# EAGLE schematic smart-kitchen-autofan (EAGLE 9.5.2)
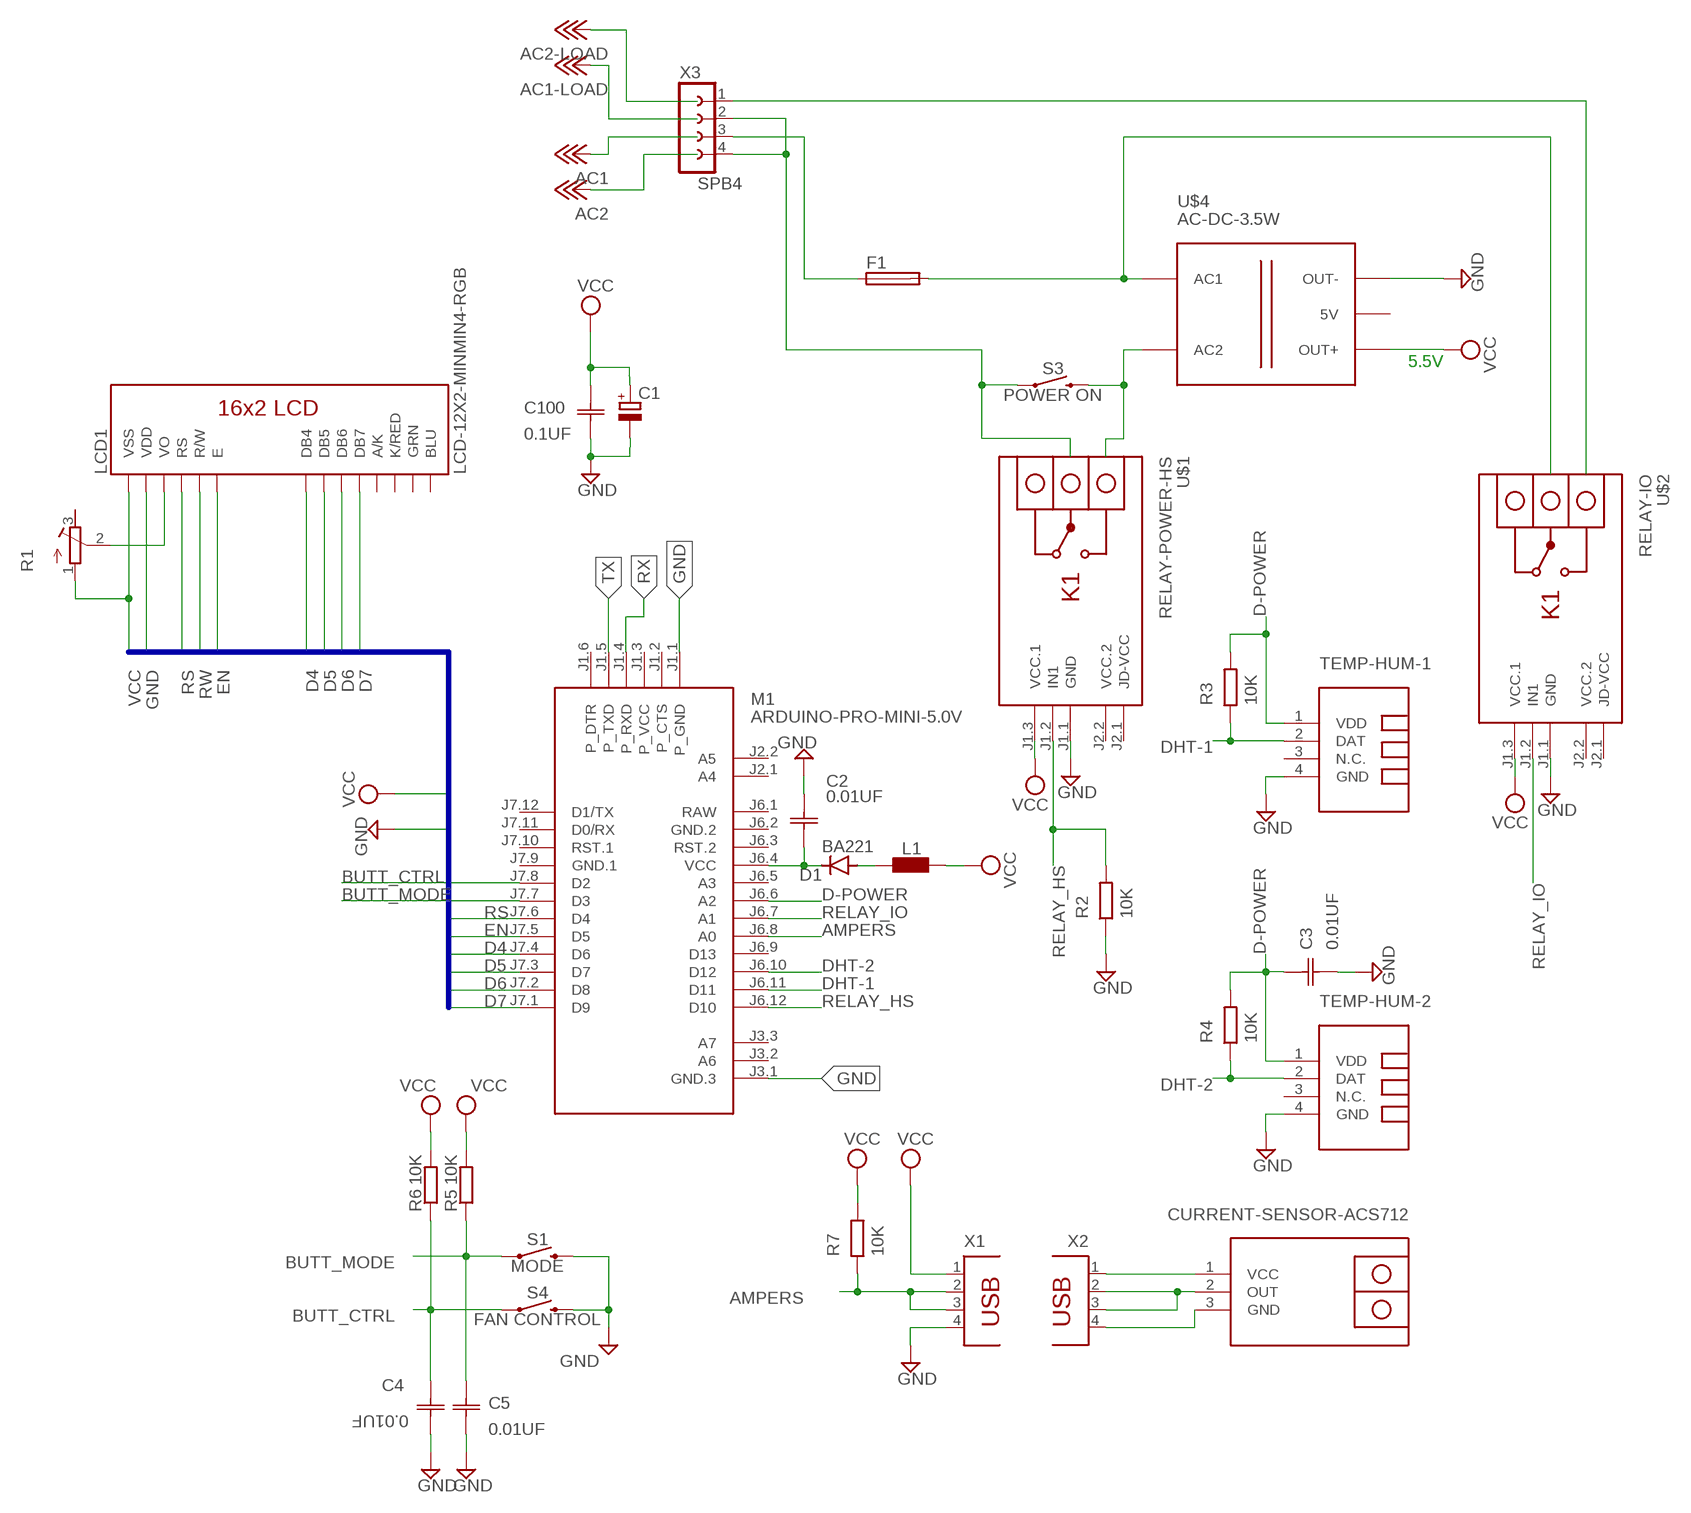
[diagram p0: schematic, sheet 1]

## Parts
C1  CPOL-EU139CLL-2R  [139CLL-2R]
C2  0.01UF  0603ZC104KA72A  [CAPC1608X90N]
C3  0.01UF  0603ZC104KA72A  [CAPC1608X90N]
C4  0.01UF  0603ZC104KA72A  [CAPC1608X90N]
C5  0.01UF  0603ZC104KA72A  [CAPC1608X90N]
C100  0.1UF  0603ZC104KA72A  [CAPC1608X90N]
D1  BA221  [DO35-10]
F1  F457  [F457]
L1  L0207/10  [0207/10]
LCD1  LCD-12X2-MINMIN4-RGB  LCD-16X2-MINMIN4-RGB  [LCD-16X2_NOSILK-KIT-4BIT]
M1  ARDUINO-PRO-MINI-5.0V  [ARDUINO-PRO-MINI]
R1  R-TRIMM5W  [RTRIM5W]
R2  10K  R  (no package)
R3  10K  R  (no package)
R4  10K  R  (no package)
R5  10K  R  (no package)
R6  10K  R  (no package)
R7  10K  R  (no package)
S1  MODE  MOMENTARY-SWITCH-SPST-PTH-6.0MM  [TACTILE_SWITCH_PTH_6.0MM]
S3  POWER ON  MOMENTARY-SWITCH-SPST-PTH-6.0MM  [TACTILE_SWITCH_PTH_6.0MM]
S4  FAN CONTROL  MOMENTARY-SWITCH-SPST-PTH-6.0MM  [TACTILE_SWITCH_PTH_6.0MM]
U$1  RELAY-POWER-HS  RELAY-1-SRD  [RELAY-1-SRD]
U$2  RELAY-IO  RELAY-1-SRD  [RELAY-1-SRD]
U$3  CURRENT-SENSOR-ACS712  [CURRENT-SENSOR-ACS712]
U$4  AC-DC-3.5W  [AC-DC-3.5W]
U$7  TEMP-HUM-1  TEMP-HUM-SENSOR-DHT22  [TEMP-HUM-SENSOR-DHT22]
U$8  TEMP-HUM-2  TEMP-HUM-SENSOR-DHT22  [TEMP-HUM-SENSOR-DHT22]
X1  PN61729  [PN61729]
X2  PN61729  [PN61729]
X3  SPB4  [SPB4]

## Nets
AMPERS: M1.J6.8(A0) R7.1 X1.2 X1.3
BUTT_CTRL: C4.1(C1) M1.J7.8(D2) R6.1 S4.1
BUTT_MODE: C5.1(C1) M1.J7.7(D3) R5.1 S1.1
D4: LCD1.11(DB4) M1.J7.4(D6)
D5: LCD1.12(DB5) M1.J7.3(D7)
D6: LCD1.13(DB6) M1.J7.2(D8)
D7: LCD1.14(DB7) M1.J7.1(D9)
D-POWER: C3.2(C2) M1.J6.6(A2) R3.2 R4.2 U$7.1(VDD) U$8.1(VDD)
DHT-1: M1.J6.11(D11) R3.1 U$7.2(DAT)
DHT-2: M1.J6.10(D12) R4.1 U$8.2(DAT)
EN: LCD1.6(E) M1.J7.5(D5)
GND: C1.- C2.2(C2) C3.1(C1) C4.2(C2) C5.2(C2) C100.1(C1) LCD1.2(VDD) M1.J1.1(P_GND) M1.J3.1(GND.3) R2.1 S1.3 S4.3 U$1.J1.1(GND) U$2.J1.1(GND) U$4.J2.1(OUT-) U$7.4(GND) U$8.4(GND) X1.4
GND1: C2.1(C1) D1.C M1.J6.4(VCC)
N$1: X3.1
N$2: S3.3 U$4.J1.2(AC2)
N$3: F1.2 U$4.J1.1(AC1)
N$4: S3.1 X3.2 X3.4
N$5: F1.1 X3.3
N$6: U$3.2(OUT) X2.2 X2.3
N$7: D1.A L1.2
N$8: U$3.1(VCC) X2.1
N$9: U$3.3(GND) X2.4
N$16: LCD1.3(VO) R1.2(S)
RELAY_HS: M1.J6.12(D10) R2.2 U$1.J1.2(IN1)
RELAY_IO: M1.J6.7(A1) U$2.J1.2(IN1)
RS: LCD1.4(RS) M1.J7.6(D4)
RW: LCD1.5(R/W)
RX: M1.J1.4(P_RXD)
TX: M1.J1.5(P_TXD)
VCC: C1.+ C100.2(C2) L1.1 LCD1.1(VSS) R1.1(A) R5.2 R6.2 R7.2 U$1.J1.3(VCC.1) U$2.J1.3(VCC.1) U$4.J2.3(OUT+) X1.1
Unconnected: M1.J1.2(P_CTS) M1.J1.3(P_VCC) M1.J1.6(P_DTR) M1.J2.1(A4) M1.J2.2(A5) M1.J3.2(A6) M1.J3.3(A7) M1.J6.3(RST.2) M1.J6.5(A3) M1.J6.9(D13) M1.J7.10(RST.1) M1.J7.11(D0/RX) M1.J7.12(D1/TX) R1.3(E) U$1.J2.1(JD-VCC) U$2.J2.1(JD-VCC) U$4.J2.2(5V) U$7.3(N.C.) U$8.3(N.C.)

## Buses
D4,D5,D6,D7,EN,GND,RS,RW,VCC

## Notes on the sheet
- 5.5V

## Power pins joined to a net without a drawn wire
A/K: LCD1.15(A/K)
BLU: LCD1.18(BLU)
GND.1: M1.J7.9(GND.1)
GND.2: M1.J6.2(GND.2)
GRN: LCD1.17(GRN)
K/RED: LCD1.16(K/RED)
RAW: M1.J6.1(RAW)
VCC.2: U$1.J2.2(VCC.2) U$2.J2.2(VCC.2)

## Library data of the parts
C1 = rcl:CPOL-EU: POLARIZED CAPACITOR, European symbol; SPICEPREFIX: C
C2-C5 = AVX:0603ZC104KA72A: Capacitor, 0603; MPN: 0603ZC104KA72A; OC_FARNELL: -; OC_NEWARK: 55J2765; SUPPLIER: AVX; TOLERANCE: ±10%; VALUE: 0.1UF; VOLTAGERATING: 10V
C100 = AVX:0603ZC104KA72A: Capacitor, 0603; MPN: 0603ZC104KA72A; OC_FARNELL: -; OC_NEWARK: 55J2765; SUPPLIER: AVX; TOLERANCE: ±10%; VOLTAGERATING: 10V
D1 = diode:BA221: DIODE high speed (Philips)
F1 = fuse:F457: FUSE HOLDER CS, Schukat; OC_FARNELL: unknown; OC_NEWARK: unknown
L1 = eagle-ltspice:L: INDUCTOR, European symbol; SPICEMODEL: NONE; SPICEPREFIX: L
LCD1 = SparkFun-Displays:LCD-16X2-MIN: RGB 16x2 parallel input LCD, 4bit only Basic 16 character by 2 line display. Typically utilizes the extremely common HD44780 parallel interface chipset SparkFun Products: Basic 16x2 RGB <https://www.sparkfun.com/products/10862>; SF_ID: LCD-10862; SPICEPREFIX: X
M1 = diy-modules:ARDUINO-PRO-MINI-*: Arduino Pro Mini and compatible devices More details available here: https://www.arduino.cc/en/Main/ArduinoBoardProMini Click here to find device on ebay.com <http://www.ebay.com/sch/arduino+pro+mini>
R1 = resistor:R-TRIMM: Trimm resistor
R2-R7 = ngspice-simulation:R: RESISTOR
S1 S3 S4 = SparkFun-Switches:MOMENTARY-SWITCH-SPST: Momentary Switch (Pushbutton) - SPST Normally-open (NO) SPST momentary switches (buttons, pushbuttons). Variants PTH-12MM - 12mm square, through-hole Momentary Pushbutton Switch - 12mm Square <https://www.sparkfun.com/products/9190> (COM-09190) PTH-6.0MM, PTH-6.0MM-KIT - 6.0mm square, through-hole Mini Pushbutton Switch <https://www.sparkfun.com/products/97> (COM-00097) KIT package intended for soldering kit's - only one side of pads' copper is exposed. PTH-RIGHT-ANGLE-KIT - Right-angle, through-hole Right Angle Tactile Button <https://www.sparkfun.com/products/10791> - Used on SparkFun BigTime Watch Kit <https://www.sparkfun.com/products/11734> SMD-12MM - 12mm square, surface-mount Tactile Button - SMD (12mm) <https://www.sparkfun.com/products/12993> (COM-12993) Used on SparkFun PicoBoard <https://www.sparkfun.com/products/11888> SMD-4.5MM - 4.5mm Square Trackball Switch Used on SparkFun Blackberry Trackballer Breakout <https://www.sparkfun.com/products/13169> SMD-4.6MMX2.8MM - 4.60mm x 2.80mm, surface mount Used on SparkFun SAMD21 Mini Breakout <https://www.sparkfun.com/products/13664> SMD-5.2MM, SMD-5.2-REDUNDANT - 5.2mm square, surface-mount Mini Pushbutton Switch - SMD <https://www.sparkfun.com/products/8720> (COM-08720) Used on Arduino Pro Mini <https://www.sparkfun.com/products/11114> REDUNDANT package connects both switch circuits together SMD-6.0X3.5MM - 6.0 x 3.5mm, surface mount Momentary Reset Switch SMD <https://www.sparkfun.com/products/8229> (COM-08229) SMD-6.2MM-TALL - 6.2mm square, surface mount Tactile Button - SMD (6mm) <https://www.sparkfun.com/products/12992> Used on SparkFun Digital Sandbox <https://www.sparkfun.com/products/12651> SMD-RIGHT-ANGLE - Right-angle, surface mount Used on SparkFun Block for Intel® Edison - Arduino <https://www.sparkfun.com/products/13036>; PROD_ID: SWCH-08441; SF_SKU: COM-00097
U$1 U$2 = diy-modules:RELAY-1-SRD: 1-Channel Relay Module based on SRD-05VDC-SL-C relays Click here to find device on ebay.com <http://www.ebay.com/sch/one+channel+isolated+relay+5v>
U$3 = diy-modules:CURRENT-SENSOR-ACS712: Isolated Bipolar Current Sensors based on ACS712 chip More details available here: http://embedded-lab.com/blog/a-brief-overview-of-allegro-acs712-current-sensor-part-1/ Click here to find device on ebay.com <http://www.ebay.com/sch/acs712+module> Note: There are many available versions with different pinout. Please check before use
U$4 = diy-modules:AC-DC-3.5W: AC/DC 3.5W Converter More details available here: https://www.itead.cc/wiki/AC-DC_Power_Module_5V_700mA Click here to find device on ebay.com <http://www.ebay.com/sch/ac+dc+3.5w+buck+step>
U$7 U$8 = diy-modules:TEMP-HUM-SENSOR-DHT22: DHT22 - digital humidity & temperature sensor Also known as: AM2302 AM2302 datasheet available here: http://akizukidenshi.com/download/ds/aosong/AM2302.pdf Click here to find device on ebay.com <http://www.ebay.com/sch/dht22+digital+sensor>
X1 X2 = con-berg:PN61729: BERG USB connector; OC_FARNELL: unknown; OC_NEWARK: unknown
X3 = con-hirschmann:SPB4: CONNECTOR 4 pins; OC_FARNELL: unknown; OC_NEWARK: unknown